# Altium schematic sheet ESP32_A4_Landscape.SchDoc
size A4; Author: Michał Berdzik; CompanyName: AGH
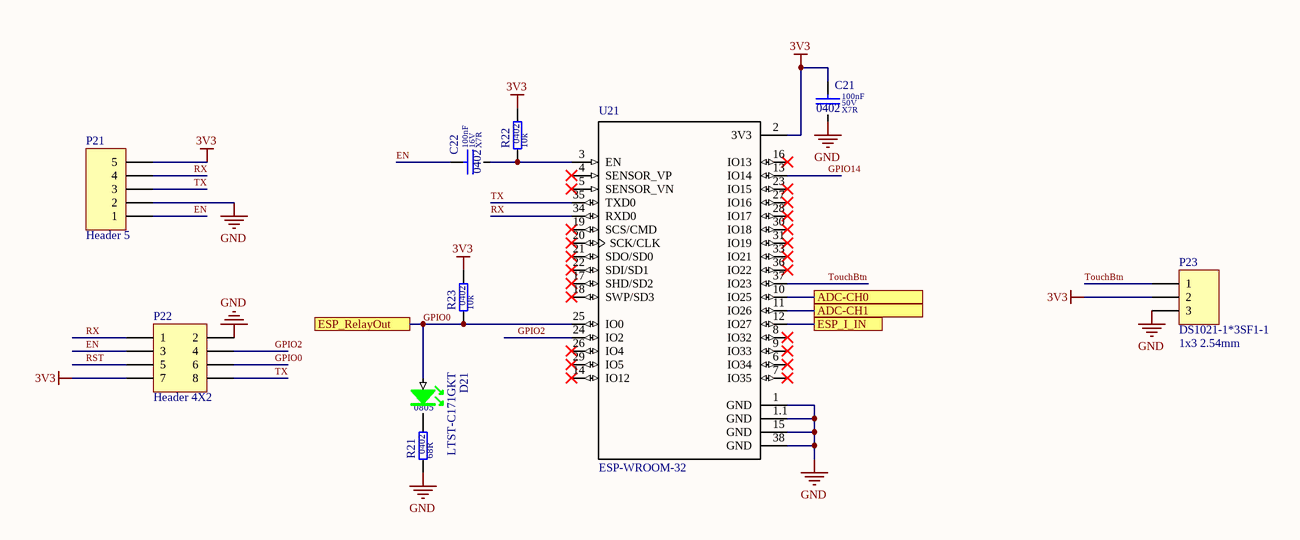
[diagram p0: ESP32_A4_Landscape.SchDoc]

## Parts
C21  value 100nF  Dielectric: X7R  Voltage: 50V  SCH_Footprint: 0402  [C_0402_1005]  (hidden comment: Ceramic X7R)
C22  value 100nF  Dielectric: X7R  Voltage: 16V  SCH_Footprint: 0402  [C_0402_1005]  (hidden comment: Ceramic X7R)
D21  value LTST-C171GKT  SCH_Footprint: 0805  [OL_0805_2012]  (hidden comment: Green led)
P21  Header 5  [HDR1X5]
P22  Header 4X2  [HDR2X4]
P23  value DS1021-1*3SF1-1  SCH_Footprint: 1x3 2.54mm  [P_HEADER_1x3_2.54]  (hidden comment: Goldpin)
R21  value 68R  SCH_Footprint: 0402  [R_0402_1005]  (hidden comment: Resistor)
R22  value 10k  SCH_Footprint: 0402  [R_0402_1005]  (hidden comment: Resistor)
R23  value 10k  SCH_Footprint: 0402  [R_0402_1005]  (hidden comment: Resistor)
U21  ESP-WROOM-32  [*MODULE_ESP-WROOM-32_ESP-WROOM-32(Primary)]

## Ports
ADC-CH0, ADC-CH1, ESP_I_IN, ESP_RelayOut

## Nets
3V3: C21.1 P21.5 P22.7 P23.2 R22.2 R23.2 U21.2(3V3)
GND: C21.2 P21.2 P22.2 P23.3 R21.1 U21.1(GND) U21.1.1(GND) U21.15(GND) U21.38(GND)
ADC-CH0: U21.10(IO25) ; port ADC-CH0
ADC-CH1: U21.11(IO26) ; port ADC-CH1
EN: C22.1 P21.1 P22.3
ESP_I_IN: U21.12(IO27) ; port ESP_I_IN
GPIO0: D21.2(A) P22.6 R23.1 U21.25(IO0) ; port ESP_RelayOut
GPIO2: P22.4 U21.24(IO2)
GPIO14: U21.13(IO14)
RST: P22.5
RX: P21.4 P22.1 U21.34(RXD0)
TouchBtn: P23.1 U21.37(IO23)
TX: P21.3 P22.8 U21.35(TXD0)
NetC22_2: C22.2 R22.1 U21.3(EN)
NetD21_1: D21.1(K) R21.2

Not connected (* = marked no-connect by the designer): U21 4(SENSOR_VP)* 5(SENSOR_VN)* 6(IO34)* 7(IO35)* 8(IO32)* 9(IO33)* 14(IO12)* 16(IO13)* 17(SHD/SD2)* 18(SWP/SD3)* 19(SCS/CMD)* 20(SCK/CLK)* 21(SDO/SD0)* 22(SDI/SD1)* 23(IO15)* 26(IO4)* 27(IO16)* 28(IO17)* 29(IO5)* 30(IO18)* 31(IO19)* 33(IO21)* 36(IO22)*

## Notes on the sheet
- Nazwa uczelni: <Company Name>
- Nazwisko konstruktora:

## Library data of the parts
C21 = C_100nF_50V_X7R_0402_10: Capacitor; Manufacturer: Murata; Manufacturer Part Number: GRM155R71H104KE14D; Tolerance (%): 10; Part Number: C_100nF_50V_X7R_0402_10; HelpURL: http://docs-europe.electrocomponents.com/webdocs/145f/0900766b8145f9d2.pdf; Supplier 1: TME; Supplier Part Number 1: GRM155R71H104KE14D; Supplier 2: RS Components; Supplier Part Number 2: 8847087; Supplier 3: Farnell; Supplier Part Number 3: 2611912; Supplier 4: Mouser; Supplier Part Number 4: 81-GRM155R71H104KE4D; Supplier 5: Digi-Key; Supplier Part Number 5: 490-10700-1-ND
C22 = C_100nF_16V_X7R_0402_10: Capacitor; Manufacturer: Murata; Manufacturer Part Number: GRM155R71C104KA88D; Tolerance (%): 10; Part Number: C_100nF_16V_X7R_0402_10; HelpURL: https://www.mouser.com/ds/2/281/c02e-2905.pdf; Supplier 1: TME; Supplier 2: RS Components; Supplier 3: Farnell; Supplier 4: Mouser; Supplier Part Number 4: 81-GRM155R71C104KA88; Supplier 5: Digi-Key
D21 = OL_G_0805_0C006_LTST-C171GKT: LED GREEN; Manufacturer: Lite-On; Part Number: OL_G_0805_0C006_LTST-C171GKT; HelpURL: http://datasheet.octopart.com/LTST-C171GKT-Lite-On-datasheet-158474.pdf; Manufacturer Part Number: LTST-C171GKT; Supplier 1: TME; Supplier Part Number 1: LTST-C171GKT; Supplier 2: RS Components; Supplier Part Number 2: 6920935; Supplier 3: Farnell; Supplier 4: Mouser; Supplier Part Number 4: 859-LTST-C171GKT; Supplier 5: Digi-Key; Supplier Part Number 5: 160-1423-1-ND
P21 = Header 5: Header, 5-Pin; LatestRevisionDate: 17-Jul-2002; LatestRevisionNote: Re-released for DXP Platform.; Publisher: Altium Limited
P22 = Header 4X2: Header, 4-Pin, Dual row; LatestRevisionDate: 17-Jul-2002; LatestRevisionNote: Re-released for DXP Platform.; Publisher: Altium Limited
P23 = P_HEADER_1x3_2.54: Header, 3-Pin; Manufacturer: Connfly; Part Number: P_HEADER_1x3_2.54; Component Type: Standard; HelpURL: http://www.tme.eu/en/Document/cc301e58a5da78cb543a94b5a5b7f06a/DS1021.pdf; Manufacturer Part Number: DS1021-1*3SF1-1; Supplier 1: TME; Supplier Part Number 1: ZL201-03G; Supplier 2: RS Components; Supplier 3: Farnell; Supplier 4: Mouser; Supplier 5: Digi-Key
R21 = R_68R_0402: Manufacturer: Yageo; Manufacturer Part Number: RC0402FR-0768RL; Voltage: 50V; Power: 63mW; Tolerance: 1%; Part Number: R_68R_0402; HelpURL: http://datasheet.octopart.com/RC0402FR-0768RL-Yageo-datasheet-8324527.pdf; Supplier 1: TME; Supplier 2: RS Components; Supplier 3: Farnell; Supplier Part Number 3: 9239090; Supplier 4: Mouser; Supplier Part Number 4: 603-RC0402FR-0768RL; Supplier 5: Digi-Key; Supplier Part Number 5: 311-68.0LRCT-ND
R22 R23 = R_10k_0402_1: Manufacturer: Yageo; Manufacturer Part Number: RC0402FR-0710KL; Voltage: 50V; Power: 63mW; Tolerance: 1%; Part Number: R_10k_0402_1; HelpURL: http://www.tme.eu/pl/Document/1a2bc76e2be68b3b1670068306778ce6/rc0402yageo.pdf; Supplier 1: TME; Supplier Part Number 1: RC0402FR-0710K; Supplier 2: RS Components; Supplier 3: Farnell; Supplier 4: Mouser; Supplier 5: Digi-Key
U21 = ESP-WROOM-32: Module: combo; GPIO, I2C x2, I2S x2, SDIO, SPI x3, UART x3; 19.5dBm; MF: Olimex LTD; Availability: Unavailable; SnapEDA_Link: https://www.snapeda.com/parts/ESP-WROOM-32/Olimex%20LTD/view-part/?ref=snap; Price: None; Package: Module Olimex LTD; MP: ESP-WROOM-32; Value: *